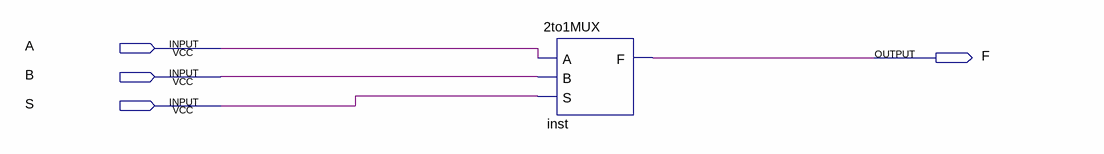
[diagram p0: schematic sheet]
// Quartus schematic testUnit.bdf as structural Verilog: 1 symbols, 4 pins
module testUnit (
  input  A,
  input  B,
  input  S,
  output F
);

  \2to1MUX  inst (.A(A), .B(B), .S(S), .F(F));
endmodule
